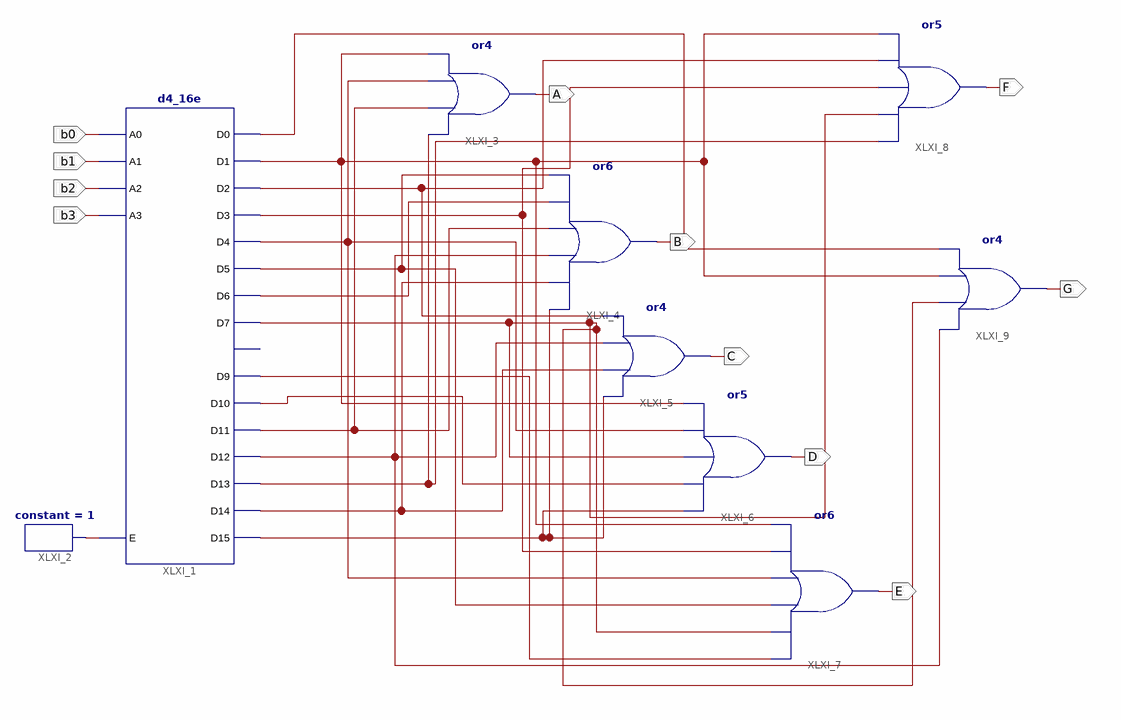
[diagram p0: schematic sheet 1]
// Xilinx ISE schematic symbol3.sch (spartan6) as structural Verilog: 9 symbols, 11 ports
module symbol3 (
  input  b3,
  input  b2,
  input  b1,
  input  b0,
  output A,
  output B,
  output C,
  output D,
  output E,
  output F,
  output G
);

  wire XLXN_1, XLXN_6, XLXN_7, XLXN_8, XLXN_9, XLXN_10, XLXN_11, XLXN_12, XLXN_13, XLXN_14, XLXN_15, XLXN_18,
       XLXN_19, XLXN_20, XLXN_22, XLXN_23;

  d4_16e XLXI_1 (
    .A0(b0), .A1(b1), .A2(b2), .A3(b3), .E(XLXN_1), .D0(XLXN_23), .D1(XLXN_6), .D10(XLXN_19), .D11(XLXN_8),
    .D12(XLXN_12), .D13(XLXN_9), .D14(XLXN_13), .D15(XLXN_14), .D2(XLXN_15), .D3(XLXN_20), .D4(XLXN_7),
    .D5(XLXN_10), .D6(XLXN_11), .D7(XLXN_18), .D9(XLXN_22));  // open: D8
  constant #(.CValue("1")) XLXI_2 (.O(XLXN_1));
  or XLXI_3 (A, XLXN_9, XLXN_8, XLXN_7, XLXN_6);
  or XLXI_4 (B, XLXN_14, XLXN_13, XLXN_12, XLXN_8, XLXN_11, XLXN_10);
  or XLXI_5 (C, XLXN_14, XLXN_13, XLXN_12, XLXN_15);
  or XLXI_6 (D, XLXN_14, XLXN_19, XLXN_18, XLXN_7, XLXN_6);
  or XLXI_7 (E, XLXN_22, XLXN_18, XLXN_10, XLXN_7, XLXN_20, XLXN_6);
  or XLXI_8 (F, XLXN_9, XLXN_18, XLXN_20, XLXN_15, XLXN_6);
  or XLXI_9 (G, XLXN_12, XLXN_18, XLXN_6, XLXN_23);
endmodule
